# EAGLE schematic ShiftIn-small (EAGLE 9.6.2)
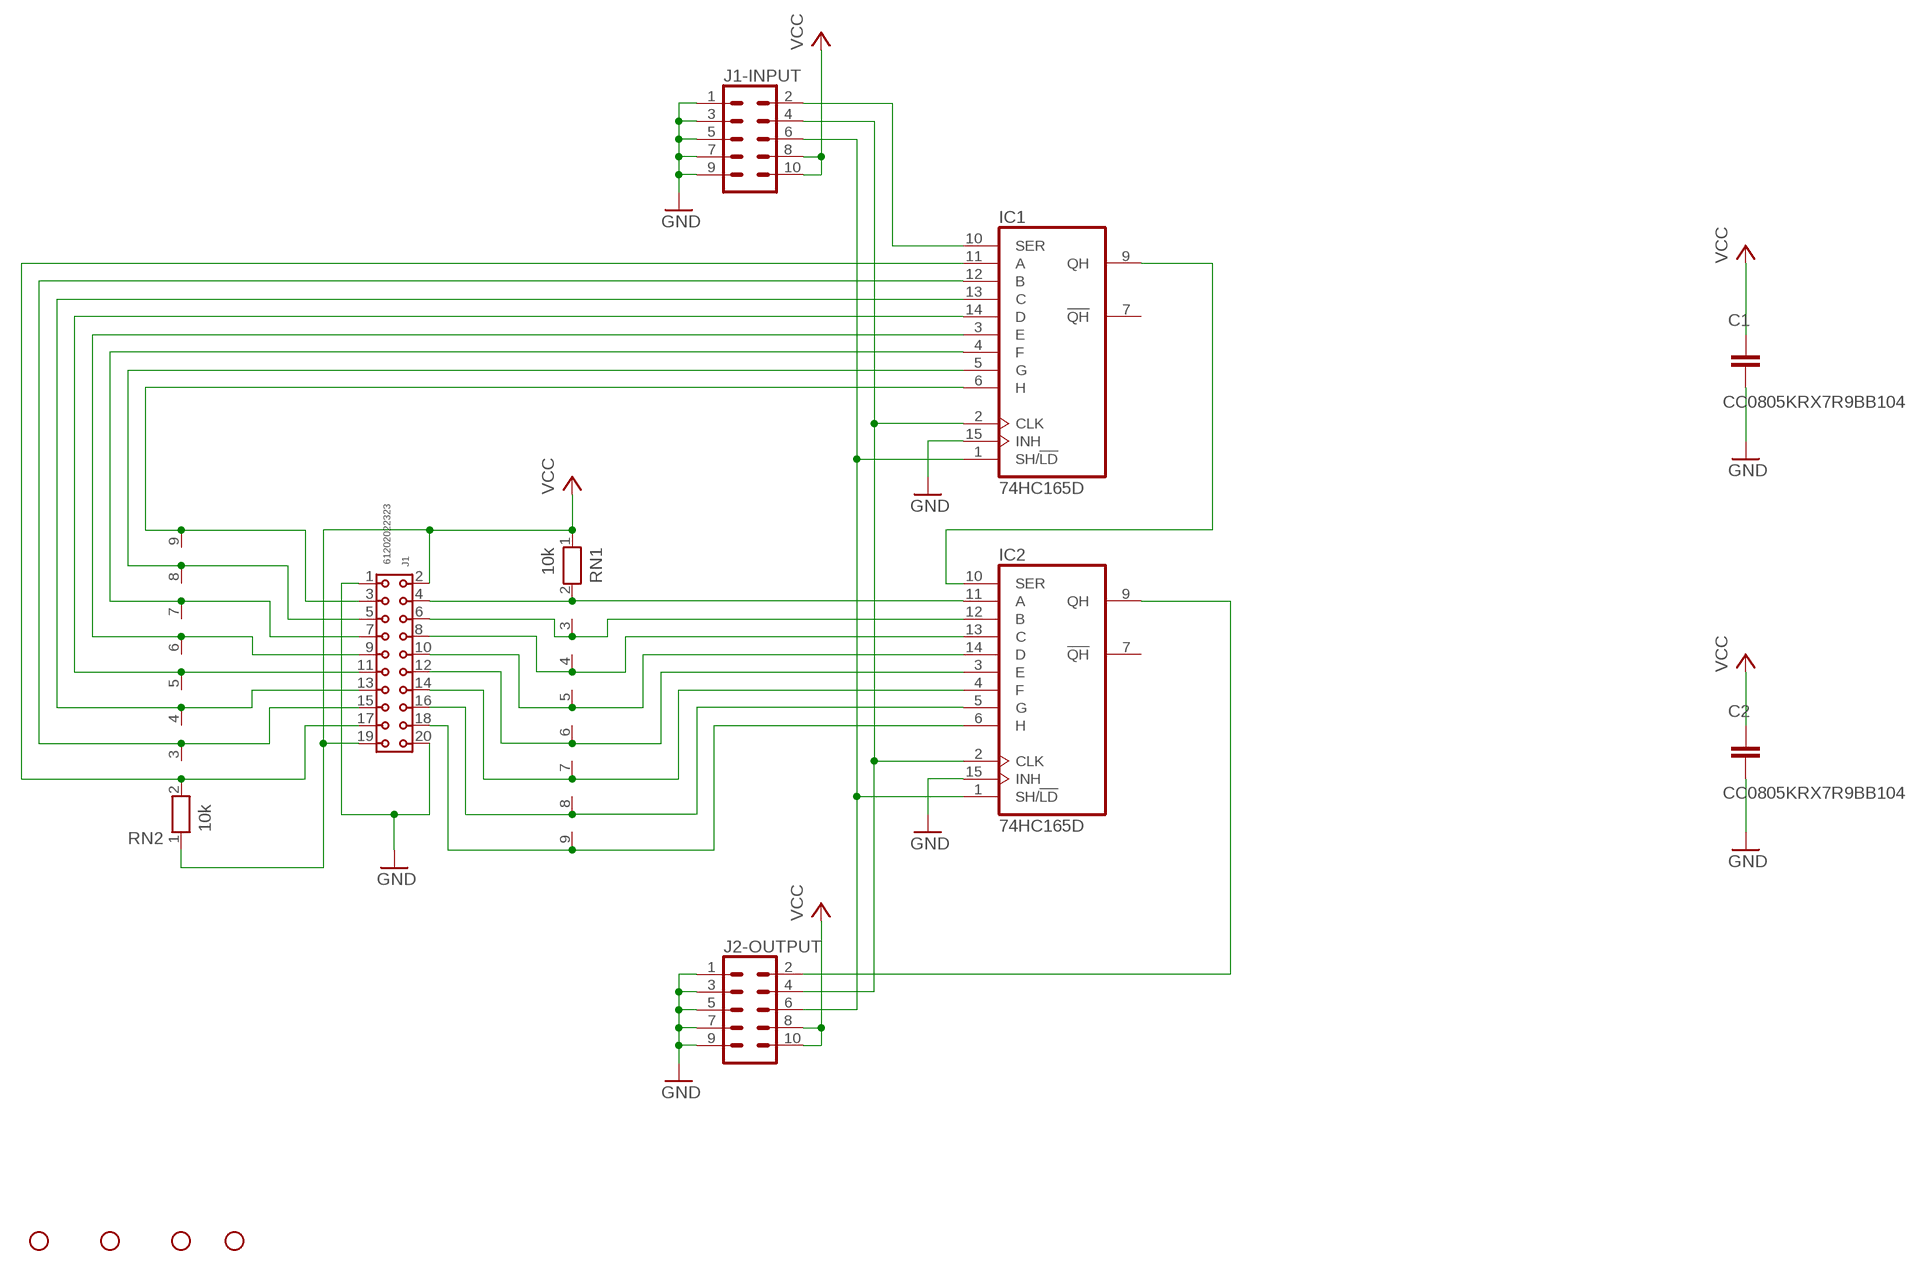
[diagram p0: schematic, sheet 1]

## Parts
C1  CC0805KRX7R9BB104  [CAP_0805]
C2  CC0805KRX7R9BB104  [CAP_0805]
H1  STAND-OFF  [STAND-OFF]
H2  STAND-OFF  [STAND-OFF]
H3  STAND-OFF  [STAND-OFF]
H4  STAND-OFF  [STAND-OFF]
IC1  74HC165D  [SO16]
IC2  74HC165D  [SO16]
J1  61202022323  6120XX22323_61202022323  [61202022323]
J1-INPUT  CONN_05X2SHD_LOCK  [2X5-SHROUDED_LOCK]
J2-OUTPUT  CONN_05X2SHD_LOCK  [2X5-SHROUDED_LOCK]
RN1  10k  RN08  [RN-9]
RN2  10k  RN08  [RN-9]

## Nets
GND [power]: C1.2 C2.2 IC1.15(INH) IC2.15(INH) J1-INPUT.1 J1-INPUT.3 J1-INPUT.5 J1-INPUT.7 J1-INPUT.9 J1.1 J1.20 J2-OUTPUT.1 J2-OUTPUT.3 J2-OUTPUT.5 J2-OUTPUT.7 J2-OUTPUT.9
N$1: IC1.2(CLK) IC2.2(CLK) J1-INPUT.4 J2-OUTPUT.4
N$2: IC1.9(QH) IC2.10(SER)
N$3: IC1.10(SER) J1-INPUT.2
N$4: IC1.11(A) J1.17 RN2.2
N$6: IC2.9(QH) J2-OUTPUT.2
N$7: IC1.12(B) J1.15 RN2.3
N$8: IC1.13(C) J1.13 RN2.4
N$9: IC1.14(D) J1.11 RN2.5
N$10: IC1.3(E) J1.9 RN2.6
N$11: IC1.4(F) J1.7 RN2.7
N$12: IC1.5(G) J1.5 RN2.8
N$13: IC1.6(H) J1.3 RN2.9
N$14: IC2.11(A) J1.4 RN1.2
N$15: IC2.12(B) J1.6 RN1.3
N$16: IC2.13(C) J1.8 RN1.4
N$17: IC2.14(D) J1.10 RN1.5
N$18: IC2.3(E) J1.12 RN1.6
N$19: IC2.4(F) J1.14 RN1.7
N$20: IC2.5(G) J1.16 RN1.8
N$21: IC2.6(H) J1.18 RN1.9
N$22: IC1.1(SH/!LD) IC2.1(SH/!LD) J1-INPUT.6 J2-OUTPUT.6
VCC [power]: C1.1 C2.1 J1-INPUT.8 J1-INPUT.10 J1.2 J1.19 J2-OUTPUT.8 J2-OUTPUT.10 RN1.1 RN2.1
Unconnected: IC1.7(!QH) IC2.7(!QH)

## Power pins joined to a net without a drawn wire
GND: IC1.8(GND) IC2.8(GND)
VCC: IC1.16(VCC) IC2.16(VCC)

## Library data of the parts
C1 C2 = Resistor_Capacitor:CC0805KRX7R9BB104: CAP CER 0.1UF 50V X7R 0805 Manufacturer's datasheet <http://www.yageo.com/documents/recent/UPY-GPHC_X7R_6.3V-to-50V_18.pdf>; CREATED_BY: PCBLayout.com; DIGIKEY_PART_NUMBER: 311-1140-2-ND; MANUFACTURER: Yageo; MPN: CC0805KRX7R9BB104; PACKAGE: SMD 0805
H1-H4 = SparkFun-Hardware:STAND-OFF: Stand Off Drill holes for mechanically mounting via screws, standoffs, etc. Note: Use the keepout ring to avoid running the screw head into surrounding components. Variant Overviews STAND-OFF - Mechanical footprint for a #4 phillips button head screw. STAND-OFF-TIGHT - Mechanical footprint for a #4 phillips button head screw, Example SparkFun Products Screw - Phillips Head (1/4", 4-40, 10 pack) <https://www.sparkfun.com/products/10453> (PRT-10453) Screw - Phillips Head (1/2", 4-40, 10 pack) <https://www.sparkfun.com/products/10452> (PRT-10452) Screw - Phillips Head (3/4", 4-40, 10 pack) <https://www.sparkfun.com/products/10451> (PRT-10451) Screw - Phillips Head (1", 4-40, 10 pack) <https://www.sparkfun.com/products/10450> (PRT-10450)
IC1 IC2 = 74xx-eu:74*165: 8-bit parallel load SHIFT REGISTER
J1 = Wurth_Connectors_WR-BHD:6120XX22323_61202022323: WR-BHD 2.54 mm Board to Cable Transition Connector KIND PROPERTIES: Pitch 2.54 mm Gender:Transition MATERIAL PROPERTIES: Insulator Material:PBT Insulator Flammability Rating UL94 V-0 Insulator Color:Black Contact Material :Copper Alloy Contact Plating :Gold Contact Type: Stamped GENERAL INFORMATION: Operating Temperature:-40 °C up to +125 °C Compliance:RoHS Working Voltage: 250 V (AC) Withstanding Voltage:500 V (AC) Contact Resistance: 20 mΩ Insulation Resistance:1000 MΩ CERTIFICATION UL Approval:E323964 PACKAGING PROPERTIES Packaging :Tray <https://www.we-online.de/katalog/media/o32892v209%20Family_WR-BHD_6120xx22323.jpg> Details see: https://www.we-online.de/katalog/en/em/BHD_2_54_BOARD_TO_CAB_TRANSITION_CONNECTOR_6120XX22323 Updated by Yingchun,Shan 2019-10-31 2019 (C) Würth Elektronik; CONTACT-RESISTANCE: 20mOhm; DATASHEET-URL: https://www.we-online.com/catalog/datasheet/61202022323.pdf; GENDER: Transition; IR: 1A; L: 30.85mm; MOUNT: THT; PACKAGING: Tray; PART-NUMBER: 61202022323; PINS: 20; PITCH: 2.54mm; TYPE: Straight; WORKING-VOLTAGE: 250V(AC)
J1-INPUT J2-OUTPUT = SparkFun-Connectors:CONN_05X2: Multi connection point. Often used as Generic Header-pin footprint for 0.1 inch spaced/style header connections For AVR SPI programming port, see special device with nice symbol: "AVR_SPI_PROG_5x2.dev" You can populate with any combo of single row headers, but if you'd like an exact match, check these: 2x5 AVR ICSP Male Header <https://www.sparkfun.com/products/778> (PRT-00778) 2x5 Pin Shrouded Header <https://www.sparkfun.com/products/8506> (PRT-08506) On any of the 0.1 inch spaced packages, you can populate with these: Break Away Headers - Straight <https://www.sparkfun.com/products/116> (PRT-00116) Break Away Male Headers - Right Angle <https://www.sparkfun.com/products/553> (PRT-00553) Female Headers <https://www.sparkfun.com/products/115> (PRT-00115) Break Away Headers - Machine Pin <https://www.sparkfun.com/products/117> (PRT-00117) Break Away Female Headers - Swiss Machine Pin <https://www.sparkfun.com/products/743> (PRT-00743) Special note: the shrouded connector mates well with our 5x2 ribbon cables: 2x5 Pin IDC Ribbon Cable <https://www.sparkfun.com/products/8535> (PRT-08535); PROD_ID: CONN-08671; SF_ID: PRT-08506
RN1 RN2 = resistor-net:RN08: RESISTOR NETWORK; OC_FARNELL: unknown; OC_NEWARK: unknown

## Net classes
0 default: width 0.254 mm
1 power: width 0.762 mm